# EAGLE design LP4-1 (EAGLE 8.6.3)
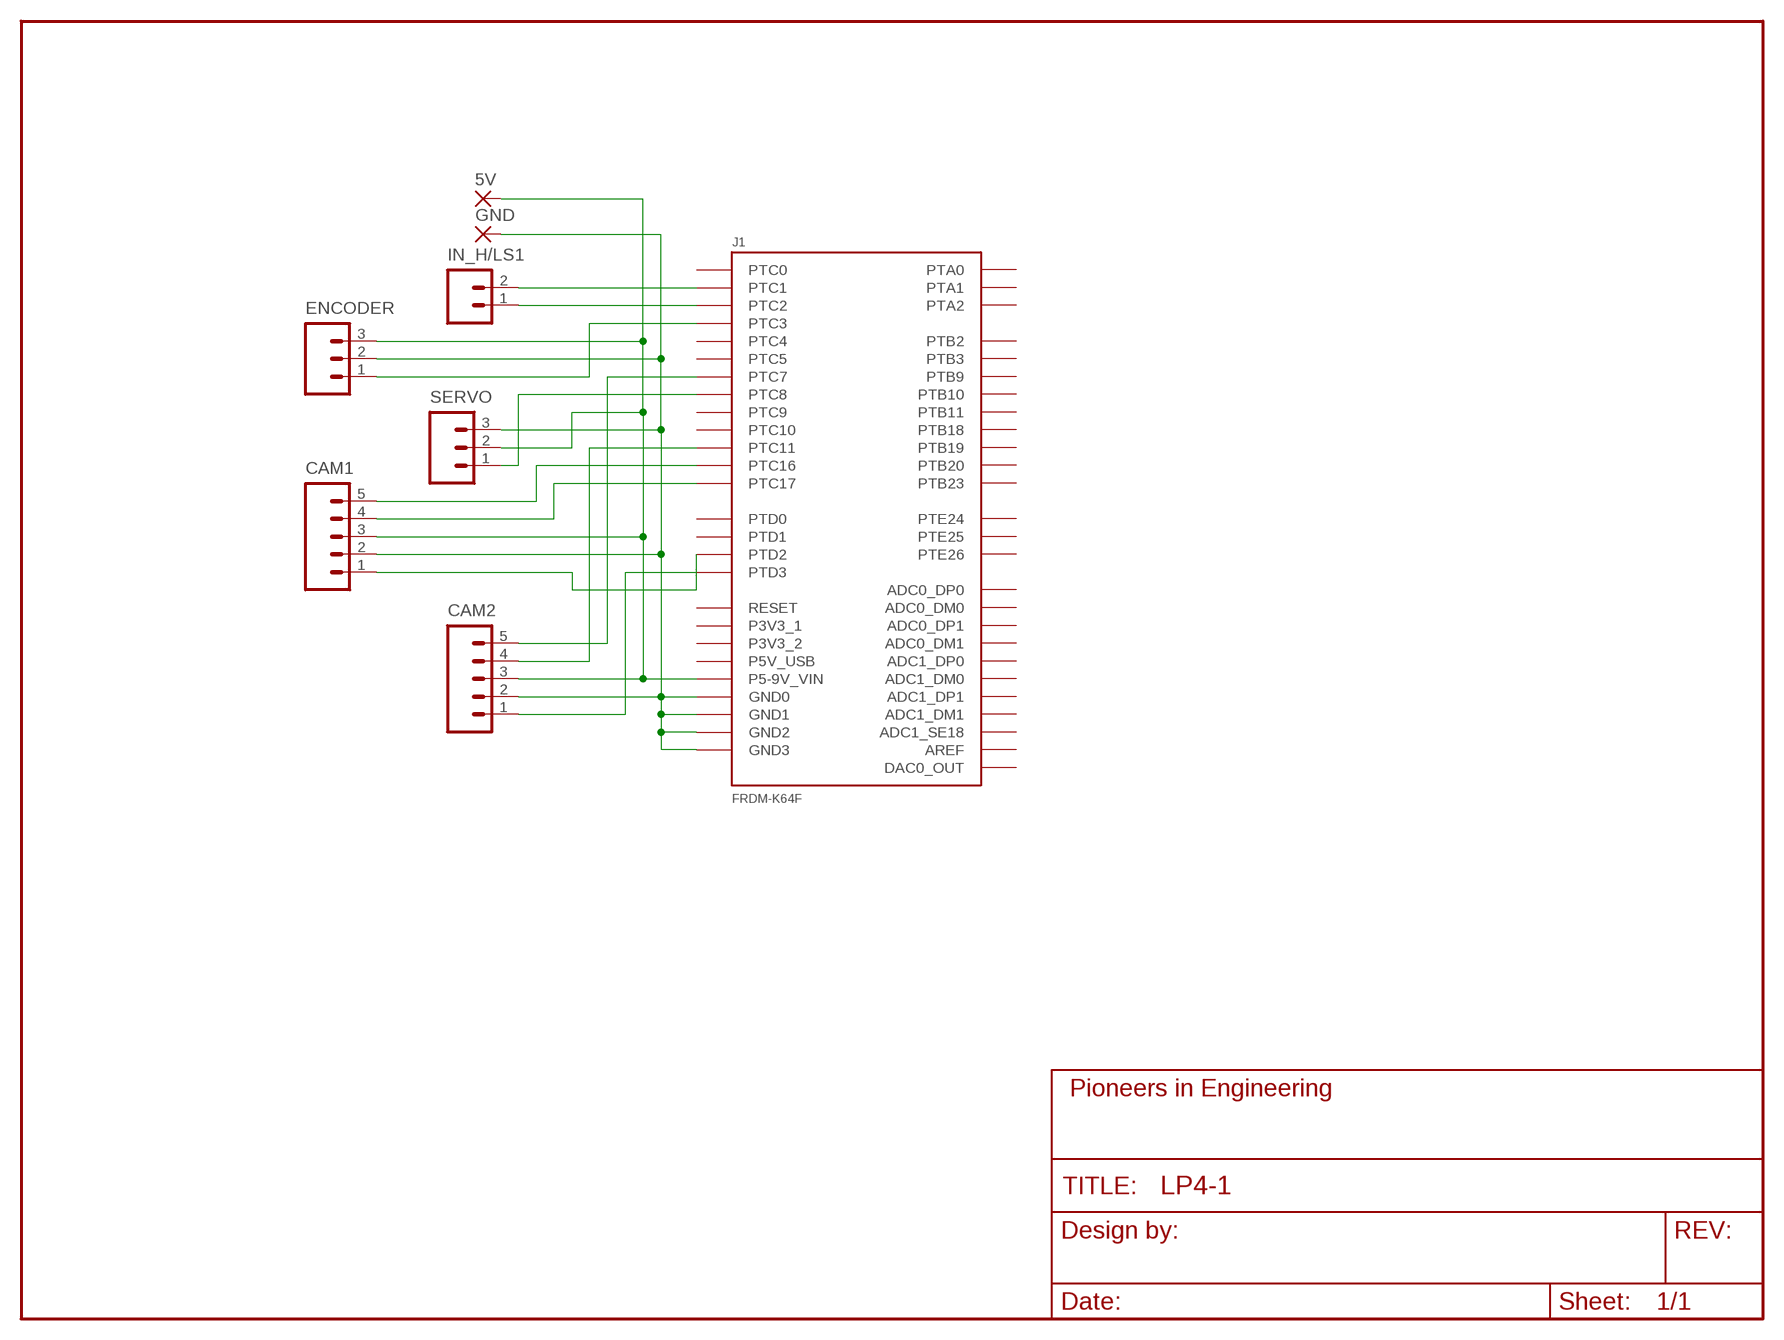
[diagram p0: schematic, sheet 1]

## Parts
5V  3,17/1,3  [3,17/1,3]
CAM1  M05PTH  [1X05]
CAM2  M05PTH  [1X05]
ENCODER  M03PTH  [1X03]
GND  3,17/1,3  [3,17/1,3]
IN_H/LS1  M02PTH  [1X02]
J1  FRDM-K64F  [FRDM-K64F]
SERVO  M03PTH  [1X03]

## Nets
GND: CAM1.2 CAM2.2 ENCODER.2 GND.1(P) J1.J2-3(GND0) J1.J2-14(GND1) J1.J3-12(GND2) J1.J3-14(GND3) SERVO.3
N$1: IN_H/LS1.2 J1.J1-5(PTC1)
N$2: IN_H/LS1.1 J1.J1-14(PTC2)
N$3: 5V.1(P) CAM1.3 CAM2.3 ENCODER.3 J1.J3-16(P5-9V_VIN) SERVO.2
N$4: ENCODER.1 J1.J1-16(PTC3)
N$5: CAM1.1 J1.J2-8(PTD2)
N$6: J1.J1-7(PTC8) SERVO.1
N$7: CAM1.5 J1.J1-2(PTC16)
N$8: CAM1.4 J1.J1-4(PTC17)
N$10: CAM2.1 J1.J2-10(PTD3)
N$11: CAM2.4 J1.J4-10(PTC11)
N$12: CAM2.5 J1.J1-13(PTC7)
Unconnected: J1.J1-1(PTB18) J1.J1-3(PTB19) J1.J1-6(PTB9) J1.J1-8(PTA1) J1.J1-9(PTC9) J1.J1-10(PTB23) J1.J1-11(PTC0) J1.J1-12(PTA2) J1.J1-15(PTC5) J1.J2-1(PTE26) J1.J2-2(PTA0) J1.J2-4(PTC4) J1.J2-5(ADC0_DP0) J1.J2-6(PTD0) J1.J2-7(ADC0_DM0) J1.J2-11(ADC1_DP0) J1.J2-12(PTD1) J1.J2-13(ADC1_DM0) J1.J2-16(AREF) J1.J2-17(ADC1_SE18) J1.J2-18(PTE25) J1.J2-20(PTE24) J1.J3-4(P3V3_1) J1.J3-6(RESET) J1.J3-8(P3V3_2) J1.J3-10(P5V_USB) J1.J4-1(ADC0_DP1) J1.J4-2(PTB2) J1.J4-3(ADC0_DM1) J1.J4-4(PTB3) J1.J4-5(ADC1_DP1) J1.J4-6(PTB10) J1.J4-7(ADC1_DM1) J1.J4-8(PTB11) J1.J4-9(PTB20) J1.J4-11(DAC0_OUT) J1.J4-12(PTC10)

## Library data of the parts
5V GND = wirepad:3,17/1,3: THROUGH-HOLE PAD
CAM1 CAM2 = ee192_1:M05: 5-pin 0.1-inch header and MTA connector Courtsey of Pioneers in Engineering; PIE-INT-REF-NUM: BULK-STOCK
ENCODER SERVO = ee192_1:M03: 3-pin 0.1-inch header and MTA connector Courtsey of Pioneers in Engineering; PIE-INT-REF-NUM: BULK-STOCK
IN_H/LS1 = ee192_1:M02: 2-pin 0.1-inch header and MTA connector Courtsey of Pioneers in Engineering; PIE-INT-REF-NUM: BULK-STOCK
J1 = ee192_1:FRDM-K64F: Shield for Freescale Freedom board FRDM-K64F by nathan wong, Team 7 Sp 2016

## Board
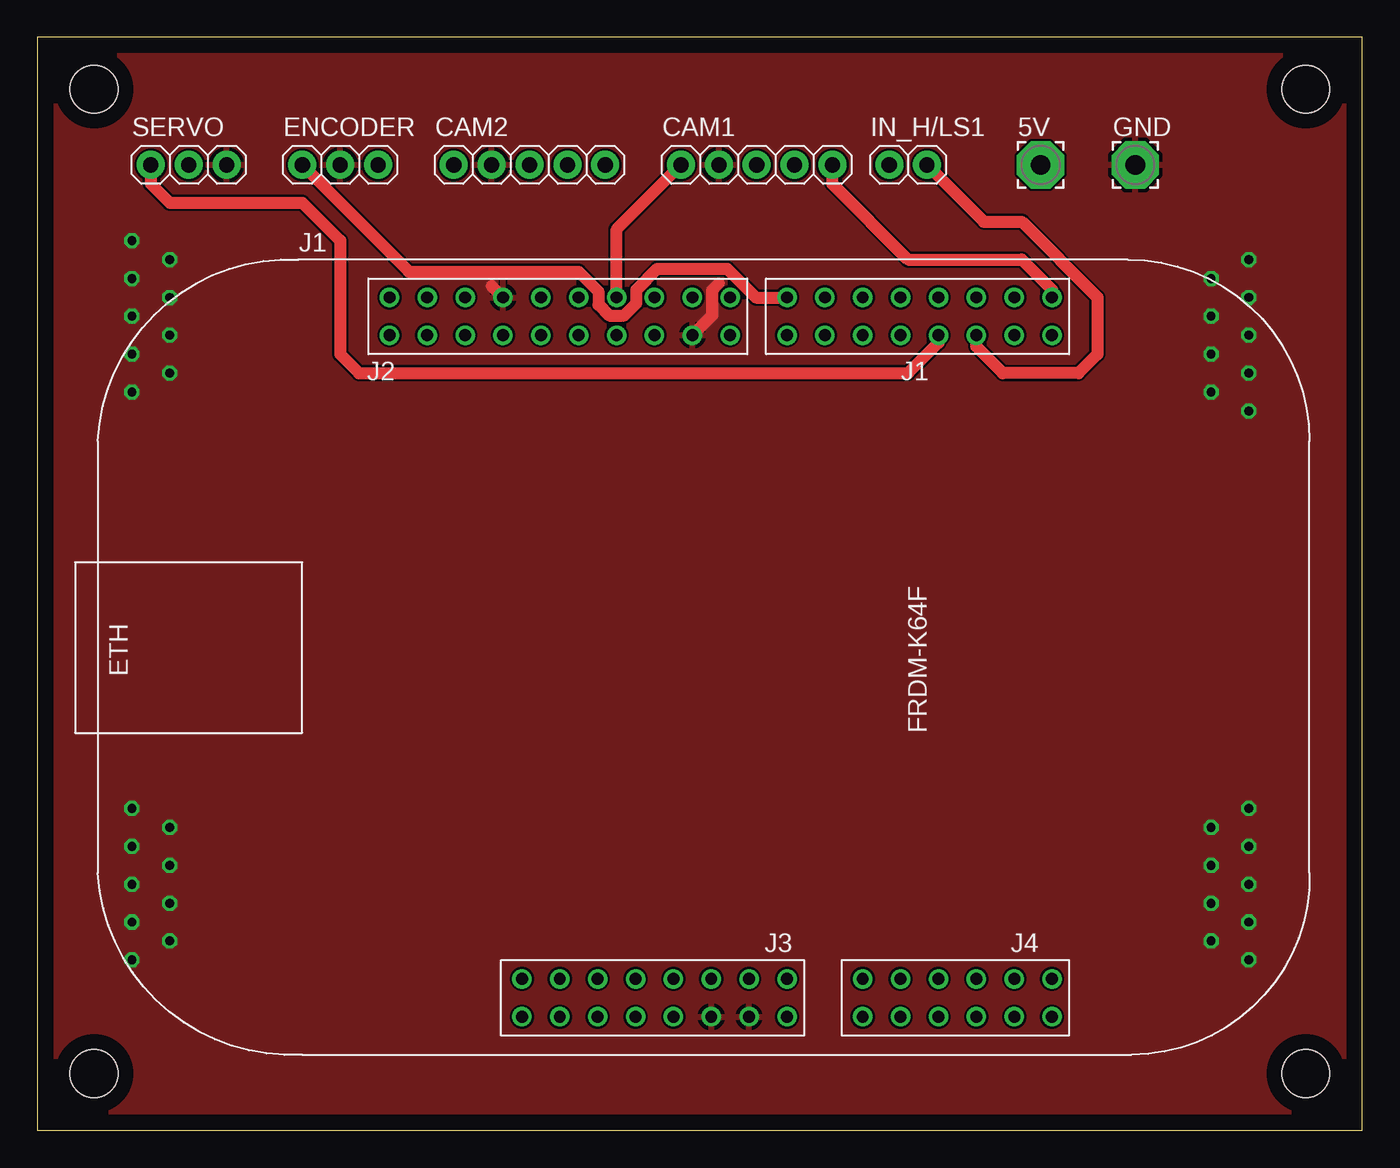
[diagram p1: board, top side]
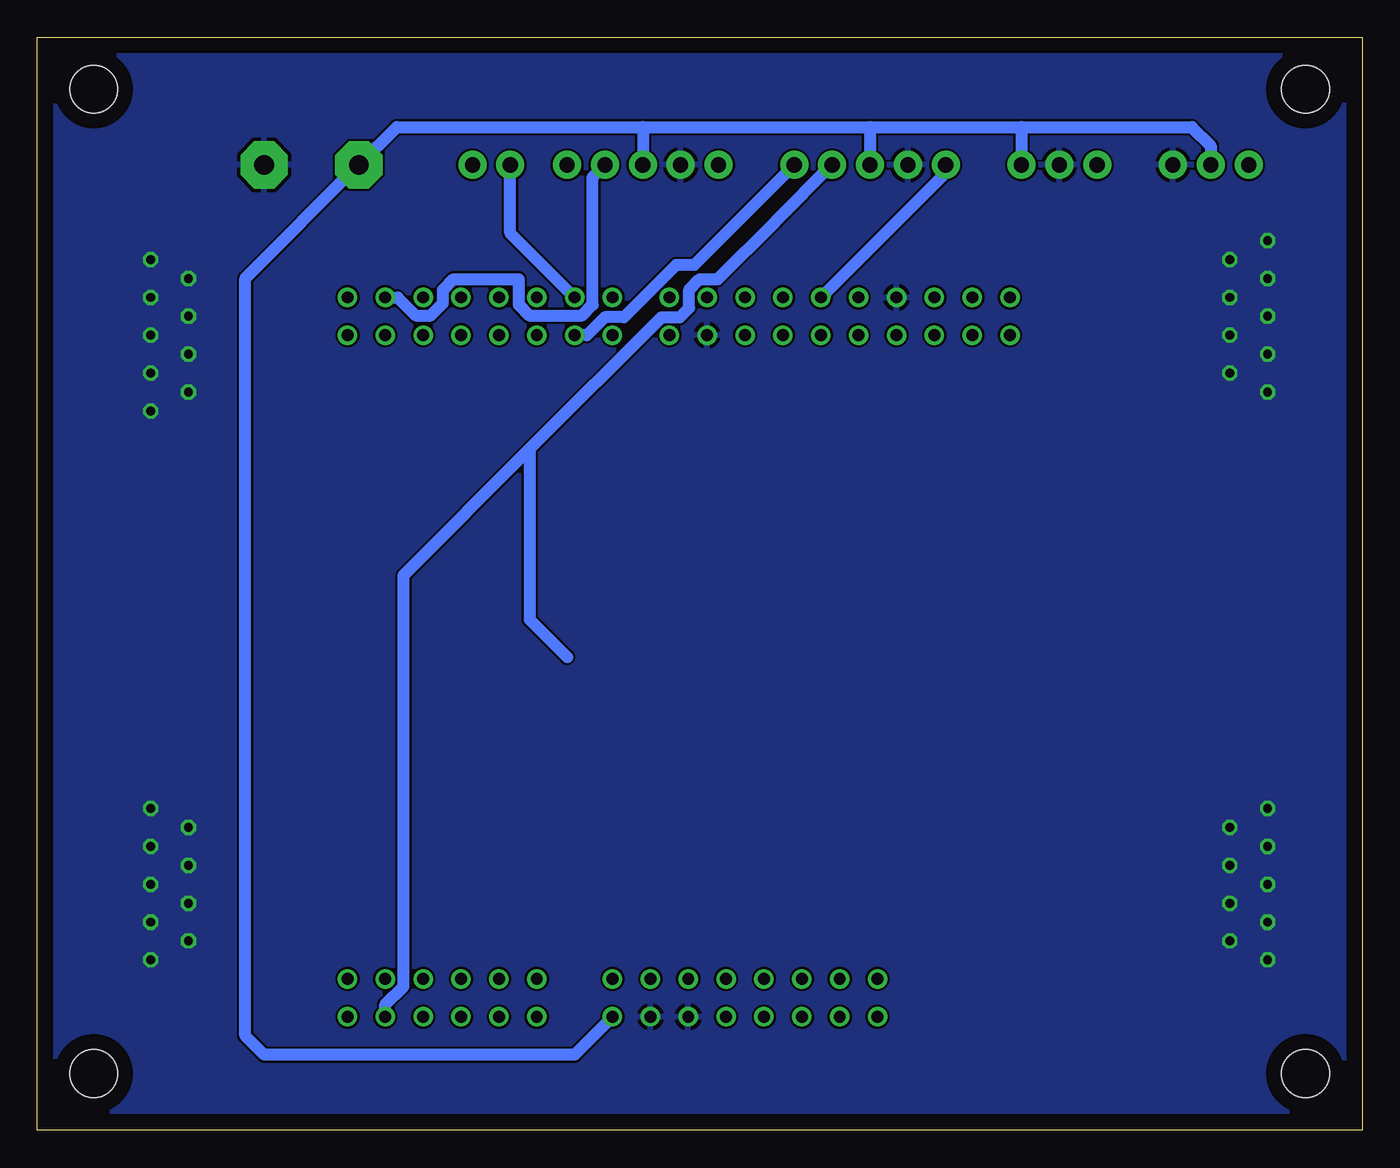
[diagram p2: board, bottom side, seen from below]

Size 88.88 x 73.33 mm. Coordinates in mm from the lower left corner, seen from the top.
Outline: 0,0 88.88,0 88.88,73.33 0,73.33 0,0
Copper layers (1*16): Top 0.035mm / dielectric 1.5mm / Bottom 0.035mm
Design rules "default": minimum track width 6mil, minimum drill 0.35mm, track to track 6mil, track to pad 6mil, pad to pad 6mil, via to via 6mil, smd to smd 6mil, copper to edge 40mil, drill to drill 6mil, minimum pad ring 10mil, minimum via ring 8mil, stop-mask expansion 4mil, vias tented up to drill 0mil, thermal gap 10mil
Holes 3.2 mm at 3.81,69.85 3.81,3.81 85.09,3.81 85.09,69.85

### Footprints (pad centres in the part's own frame; a part is rotated, then mirrored left to right if it is on the bottom)
3,17/1,3 = drill 1.321 pad 3.175 octagon: 1 0,0
1X05 = drill 1.016 pad 1.88: 1 -5.08,0; 2 -2.54,0; 3 0,0; 4 2.54,0; 5 5.08,0
1X03 = drill 1.016 pad 1.88: 1 -2.54,0; 2 0,0; 3 2.54,0
1X02 = drill 1.016 pad 1.88: 1 -1.27,0; 2 1.27,0
FRDM-K64F = drill 0.8: J1-1 23.622,21.59; J1-2 23.622,24.13; J1-3 21.082,21.59; J1-4 21.082,24.13; J1-5 18.542,21.59; J1-6 18.542,24.13; J1-7 16.002,21.59; J1-8 16.002,24.13; J1-9 13.462,21.59; J1-10 13.462,24.13; J1-11 10.922,21.59; J1-12 10.922,24.13; J1-13 8.382,21.59; J1-14 8.382,24.13; J1-15 5.842,21.59; J1-16 5.842,24.13; J2-1 2.032,21.59; J2-2 2.032,24.13; J2-3 -0.508,21.59; J2-4 -0.508,24.13; J2-5 -3.048,21.59; J2-6 -3.048,24.13; J2-7 -5.588,21.59; J2-8 -5.588,24.13; J2-9 -8.128,21.59; J2-10 -8.128,24.13; J2-11 -10.668,21.59; J2-12 -10.668,24.13; J2-13 -13.208,21.59; J2-14 -13.208,24.13; J2-15 -15.748,21.59; J2-16 -15.748,24.13; J2-17 -18.288,21.59; J2-18 -18.288,24.13; J2-19 -20.828,21.59; J2-20 -20.828,24.13; J3-1 -11.938,-21.59; J3-2 -11.938,-24.13; J3-3 -9.398,-21.59; J3-4 -9.398,-24.13; J3-5 -6.858,-21.59; J3-6 -6.858,-24.13; J3-7 -4.318,-21.59; J3-8 -4.318,-24.13; J3-9 -1.778,-21.59; J3-10 -1.778,-24.13; J3-11 0.762,-21.59; J3-12 0.762,-24.13; J3-13 3.302,-21.59; J3-14 3.302,-24.13; J3-15 5.842,-21.59; J3-16 5.842,-24.13; J4-1 10.922,-21.59; J4-2 10.922,-24.13; J4-3 13.462,-21.59; J4-4 13.462,-24.13; J4-5 16.002,-21.59; J4-6 16.002,-24.13; J4-7 18.542,-21.59; J4-8 18.542,-24.13; J4-9 21.082,-21.59; J4-10 21.082,-24.13; J4-11 23.622,-21.59; J4-12 23.622,-24.13

### Placement (x,y rotation side)
5V  67.31,64.77 0 top
CAM1  48.26,64.77 0 top
CAM2  33.02,64.77 0 top
ENCODER  20.32,64.77 0 top
GND  73.66,64.77 0 top
IN_H/LS1  58.42,64.77 0 top
J1  44.45,31.75 0 top
SERVO  10.16,64.77 0 top

### Tracks (layer width: path | path; a pad name or v marks a point on that pad's centre or on a via)
GND  (via drill 0.6)
  Top 0.813: 30.48,56.64 J1.J2-14 | 45.72,56.83 45.27,56.38 45.27,54.67 J1.J2-3
  other vias: 78.74,57.15 78.74,54.61 78.74,52.07 78.74,49.53 81.28,48.26 81.28,50.8 81.28,53.34 81.28,55.88 81.28,58.42 81.28,21.59 78.74,20.32 78.74,17.78 81.28,19.05 81.28,16.51 78.74,15.24 81.28,13.97 78.74,12.7 81.28,11.43 6.35,11.43 6.35,13.97 8.89,12.7 6.35,16.51 8.89,15.24 6.35,19.05 8.89,17.78 8.89,20.32 6.35,21.59 6.35,49.53 6.35,52.07 6.35,54.61 6.35,57.15 6.35,59.69 8.89,58.42 8.89,55.88 8.89,53.34 8.89,50.8
  pour Top: 86.36,72.39 2.54,72.39 1.27,71.12 1.27,2.54 2.54,1.27 86.36,1.27 87.63,2.54 87.63,71.12
  pour Bottom: 2.54,72.39 1.27,71.12 1.27,2.54 2.54,1.27 86.36,1.27 87.63,2.54 87.63,71.12 86.36,72.39
N$1
  Top 0.813: IN_H/LS1.2 63.5,60.96 66.04,60.96 71.12,55.88 71.12,52.07 69.85,50.8 64.77,50.8 62.99,52.58 J1.J1-5
N$2
  Bottom 0.813: J1.J1-14 57.15,60.2 IN_H/LS1.1
N$3
  Bottom 0.813: 48.26,67.31 CAM1.3 | 48.26,67.31 64.77,67.31 5V.1 74.93,57.15 74.93,6.35 73.66,5.08 52.83,5.08 J1.J3-16 | 48.26,67.31 33.02,67.31 | 33.02,67.31 CAM2.3 | 33.02,67.31 22.86,67.31 | 22.86,67.31 11.43,67.31 10.16,66.04 SERVO.2 | 22.86,67.31 ENCODER.3
N$4
  Top 0.813: J1.J1-16 48.2,55.88 46.28,57.8 41.61,57.8 40.19,56.38 40.19,55.49 39.36,54.67 38.36,54.67 37.65,55.38 37.65,56.27 36.31,57.61 24.94,57.61 ENCODER.1
N$5
  Top 0.813: J1.J2-8 38.86,60.45 CAM1.1
N$6
  Top 0.813: J1.J1-7 60.45,52.83 58.42,50.8 21.59,50.8 20.32,52.07 20.32,59.69 17.78,62.23 8.89,62.23 7.62,63.5 SERVO.1
N$7
  Top 0.813: J1.J1-2 68.07,56.39 66.04,58.42 58.42,58.42 53.34,63.5 CAM1.5
N$8
  Bottom 0.813: J1.J1-4 64.71,55.88 63.49,54.67 62.49,54.67 61.67,55.49 61.67,56.38 60.95,57.09 56.59,57.09 56.59,55.38 55.87,54.67 52.33,54.67 51.62,55.38 51.62,63.95 CAM1.4
N$10
  Bottom 0.813: CAM2.1 27.94,64.26 J1.J2-10
N$11
  Bottom 0.813: J1.J4-10 65.53,8.45 64.32,9.66 64.32,37.22 55.85,45.69 | CAM2.4 39.37,60.96 43.24,57.09 44.44,57.09 45.16,56.38 45.16,55.18 45.78,54.55 46.98,54.55 55.85,45.69 | 55.85,45.69 | 55.85,45.69 55.85,34.26 53.34,31.75
N$12
  Bottom 0.813: CAM2.5 44.81,58.06 46.02,58.06 49.52,54.55 50.79,54.55 52.01,53.34 J1.J1-13